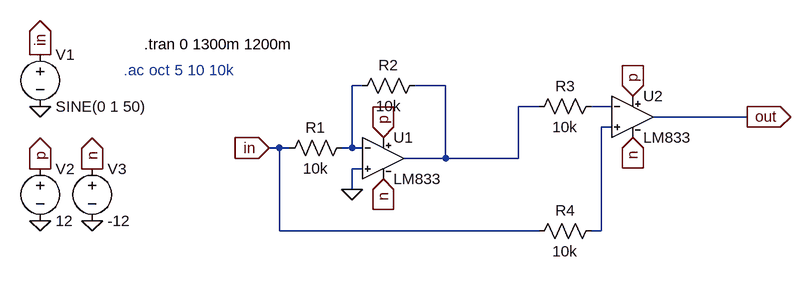
[diagram p0: schematic comparator-balanced.asc]
comparator-balanced.asc, the LTspice schematic file:
Version 4
SHEET 1 1028 680
WIRE 352 256 336 256
WIRE 480 256 432 256
WIRE 624 288 592 288
WIRE 736 288 704 288
WIRE 944 304 800 304
WIRE 736 320 720 320
WIRE 224 352 208 352
WIRE 240 352 224 352
WIRE 336 352 336 256
WIRE 336 352 320 352
WIRE 352 352 336 352
WIRE 480 368 480 256
WIRE 480 368 416 368
WIRE 592 368 592 288
WIRE 592 368 480 368
WIRE 352 384 336 384
WIRE 336 416 336 384
WIRE 224 480 224 352
WIRE 624 480 224 480
WIRE 720 480 720 320
WIRE 720 480 704 480
FLAG -144 288 0
FLAG -144 464 0
FLAG -64 464 0
FLAG -144 384 p
IOPIN -144 384 Out
FLAG -64 384 n
IOPIN -64 384 Out
FLAG 768 272 p
IOPIN 768 272 In
FLAG 768 336 n
IOPIN 768 336 In
FLAG -144 208 in
IOPIN -144 208 Out
FLAG 208 352 in
IOPIN 208 352 In
FLAG 944 304 out
IOPIN 944 304 Out
FLAG 384 336 p
IOPIN 384 336 In
FLAG 384 400 n
IOPIN 384 400 In
FLAG 336 416 0
SYMBOL Voltage -144 192 R0
SYMATTR InstName V1
SYMATTR Value SINE(0 1 50)
SYMATTR Value2 AC 1
SYMBOL Voltage -144 368 R0
SYMATTR InstName V2
SYMATTR Value 12
SYMBOL Voltage -64 368 R0
SYMATTR InstName V3
SYMATTR Value -12
SYMBOL Res 336 336 R90
WINDOW 0 0 56 VBottom 2
WINDOW 3 32 56 VTop 2
SYMATTR InstName R1
SYMATTR Value 10k
SYMBOL Res 448 240 R90
WINDOW 0 0 56 VBottom 2
WINDOW 3 32 56 VTop 2
SYMATTR InstName R2
SYMATTR Value 10k
SYMBOL Res 720 272 R90
WINDOW 0 0 56 VBottom 2
WINDOW 3 32 56 VTop 2
SYMATTR InstName R3
SYMATTR Value 10k
SYMBOL Res 720 464 R90
WINDOW 0 0 56 VBottom 2
WINDOW 3 32 56 VTop 2
SYMATTR InstName R4
SYMATTR Value 10k
SYMBOL LM833 384 304 R0
SYMATTR InstName U1
SYMBOL LM833 768 240 R0
SYMATTR InstName U2
TEXT 16 192 Left 2 !.tran 0 1300m 1200m
TEXT -16 232 Left 2 ;.ac oct 5 10 10k

The netlist it stands for:
* comparator-balanced.asc
V1 in 0 SINE(0 1 50) AC 1
V2 p 0 12
V3 n 0 -12
R1 N001 in 10k
R2 N002 N001 10k
R3 N003 N002 10k
R4 N004 in 10k
XU1 0 N001 p n N002 LM833  ; pins In+ In- V+ V- OUT
XU2 N004 N003 p n out LM833  ; pins In+ In- V+ V- OUT
.tran 0 1300m 1200m
* .ac oct 5 10 10k
.lib LM833.sub
.backanno
.end